# EasyEDA Pro project ProPrj_Anniversary_2026-05-06.epro, schematic LCD_TFT_Breakout_1in8_128x160
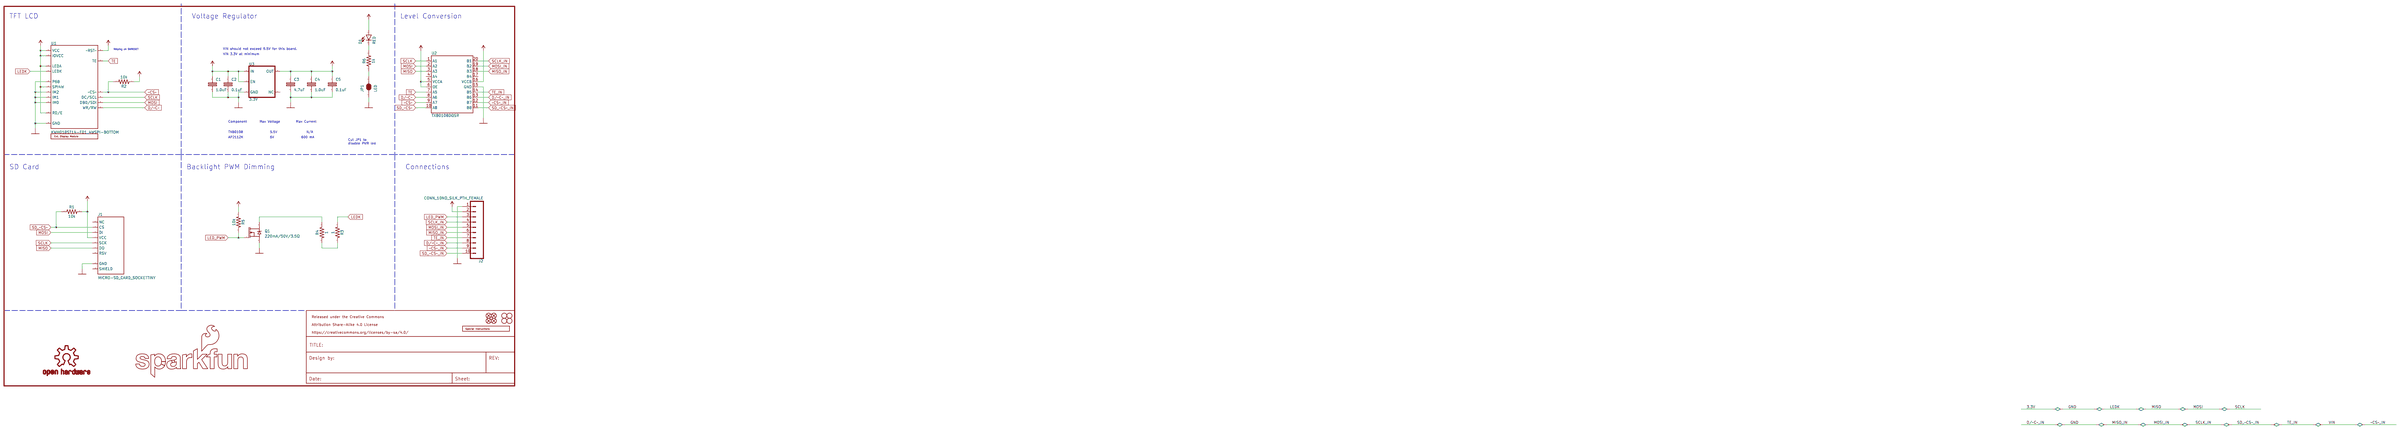
[diagram p0: schematic sheet]

## Parts
C1  1.0uF  [0603]
C2  0.1uF  [0603]
C3  4.7uF  [0603]
C4  1.0uF  [0603]
C5  0.1uF  [0603]
D1  RED  [LED-0603]
FD1  FIDUCIAL1X2  [FIDUCIAL-1X2]
FD2  FIDUCIAL1X2  [FIDUCIAL-1X2]
FD3  FIDUCIAL1X2  [FIDUCIAL-1X2]
FD4  FIDUCIAL1X2  [FIDUCIAL-1X2]
FRAME1  FRAME-LETTER  [CREATIVE_COMMONS]  (sections G$1,V)
H1  STAND-OFF  [STAND-OFF]
H2  STAND-OFF  [STAND-OFF]
H3  STAND-OFF  [STAND-OFF]
H4  STAND-OFF  [STAND-OFF]
J1  MICRO-SD_CARD_SOCKETTINY  [MICROSD_TINY]
J2  CONN_10NO_SILK_PTH_FEMALE  [1X10_NO_SILK]
JP1  LED  [SMT-JUMPER_2_NC_TRACE_SILK]
LOGO1  SFE_LOGO_NAME_FLAME.3_INCH  [SFE_LOGO_NAME_FLAME_.3]
LOGO2  SPECIAL_INSTRUCTIONS-PRODUCTION  [PRODUCTION_INSTRUCTIONS]
LOGO3  OSHW-LOGOS  [OSHW-LOGO-S]
Q1  220mA/50V/3.5Ω  [SOT23-3]
R1  10k  [0603]
R2  10k  [0603]
R3  1  [0603]
R4  1  [0603]
R5  10k  [0603]
R6  1k  [0603]
U1  KWH018ST14-F01_4WSPI-BOTTOM  [FPC05040-17204]
U2  TXB0108DQSR  [UFDFN-20]
U3  3.3V  [SOT23-5]
U$33  EXTERNAL_DISP-KWH018ST14-F01  [KWH018ST14-F01_HOLES]

## Library data of the parts
C1 C4 = SparkFun-Capacitors_1.0UF_-0603-16V-10%
C2 C5 = SparkFun-Capacitors_0.1UF_-0603-100V-10%
C3 = SparkFun-Capacitors_4.7UF_-0603-6.3V-(10%)
D1 = SparkFun-LED_LED-RED_0603: PROD_ID: DIO-00819
FD1-FD4 = SparkFun-Aesthetics_FIDUCIAL_1X2
FRAME1 = SparkFun-Aesthetics_FRAME-LETTER_: DESIGNER: Owen Lyke; REV: v10; SHEET: 1/1; DRAWING_NAME: LCD_TFT_Breakout_1in8_128x160
H1-H4 = SparkFun-Hardware_STAND-OFF_
J1 = SparkFun-Connectors_MICRO-SD_CARD_SOCKET_TINY: PROD_ID: CONN-13500
J2 = SparkFun-Connectors_CONN_10_NO_SILK_PTH_FEMALE: PROD_ID: CONN-11563
JP1 = SparkFun-Jumpers_JUMPER-SMT_2_NC_TRACE__SILK
LOGO1 = SparkFun-Aesthetics_SFE_LOGO_NAME_FLAME_.3_INCH
LOGO2 = SparkFun-Aesthetics_SPECIAL_INSTRUCTIONS_-PRODUCTION
LOGO3 = SparkFun-Aesthetics_OSHW-LOGO_S
Q1 = SparkFun-DiscreteSemi_MOSFET-NCH_-BSS138: PROD_ID: TRANS-00830
R1 R2 R5 = SparkFun-Resistors_10KOHM_-0603-1/10W-1%
R3 R4 = SparkFun-Resistors_1OHM_-0603-1/10W-1%
R6 = SparkFun-Resistors_1KOHM_-0603-1/10W-1%: PROD_ID: CAP-08390
U1 = SparkFun-Displays_KWH018ST14-F01_4WSPI_-BOTTOM: PROD_ID: CONN-14082; PROD_ID1: LCD-14196
U2 = SparkFun-IC-Comms_TXB0108_: PROD_ID: IC-12292
U3 = SparkFun-IC-Power_V_REG_AP2112_K-3.3V: PROD_ID: VREG-12457
U$33 = SparkFun-Displays_EXTERNAL_DISP_-KWH018ST14-F01: PROD_ID: LCD-14196

## Nets
3.3V: C1.1 C1.2 C2.1 C2.2 C3.1 C3.2 C4.1 C4.2 C5.1 C5.2 D1.A J1.3(DI) J1.4(VCC) J1.5(SCK) J1.6(GND) J1.7(DO) J2.1 J2.2 J2.4 J2.5 J2.6 J2.7 J2.8 J2.9 J2.10 JP1.1 Q1.2(S) R1.2 R2.1 R3.2 R5.2 U1.P$1(LEDA) U1.P$2(LEDK) U1.P$3*20(GND) U1.P$4(~RST~) U1.P$5(VCC) U1.P$6(IOVCC) U1.P$25(DB0/SDI) U1.P$26(RD/E) U1.P$28(DC/SCL) U1.P$30(SPI4W) U1.P$31(P68) U1.P$32(IM2) U1.P$33(IM1) U1.P$34(IM0) U2.1(A1) U2.2(A2) U2.3(A3) U2.5(VCCA) U2.6(OE) U2.11(B8) U2.12(B7) U2.13(B6) U2.14(B5) U2.15(GND) U2.16(VCCB) U2.18(B3) U2.19(B2) U2.20(B1) U3.1(IN) U3.2(GND) U3.3(EN) U3.5(OUT)
D/~C~: U1.P$27(WR/RW) U2.8(A6)
LED_PWM: J2.3 Q1.1(G) R5.1
N$1: D1.C R6.2
N$2: JP1.2 R6.1
N$3: R3.1 R4.2
N$5: Q1.3(D) R4.1
SD_~CS~: J1.2(CS) R1.1 U2.10(A8)
TE: U1.P$7(TE) U2.7(A5)
~CS~: R2.2 U1.P$29(~CS~) U2.9(A7)

Not connected (* = marked no-connect by the designer): J1 1*2(RSV) 9(NC) GND1*6(SHIELD); U2 4(A4) 17(B4); U3 4(NC)

## Notes on the sheet
- TFT LCD
- Voltage Regulator
- Level Conversion
- Relying on SWRESET
- VIN 3.3V at minimum
- VIN should not exceed 5.5V for this board.
- Component
- Max Voltage
- Max Current
- TXB0108
- 5.5V
- N/A
- AP2112K
- 6V
- 600 mA
- Cut JP1 to
  disable PWR led
- SD Card
- Backlight PWM Dimming
- Connections
